# EAGLE design MGBC-PWR-01_1-3_2 (EAGLE 9.6.2)
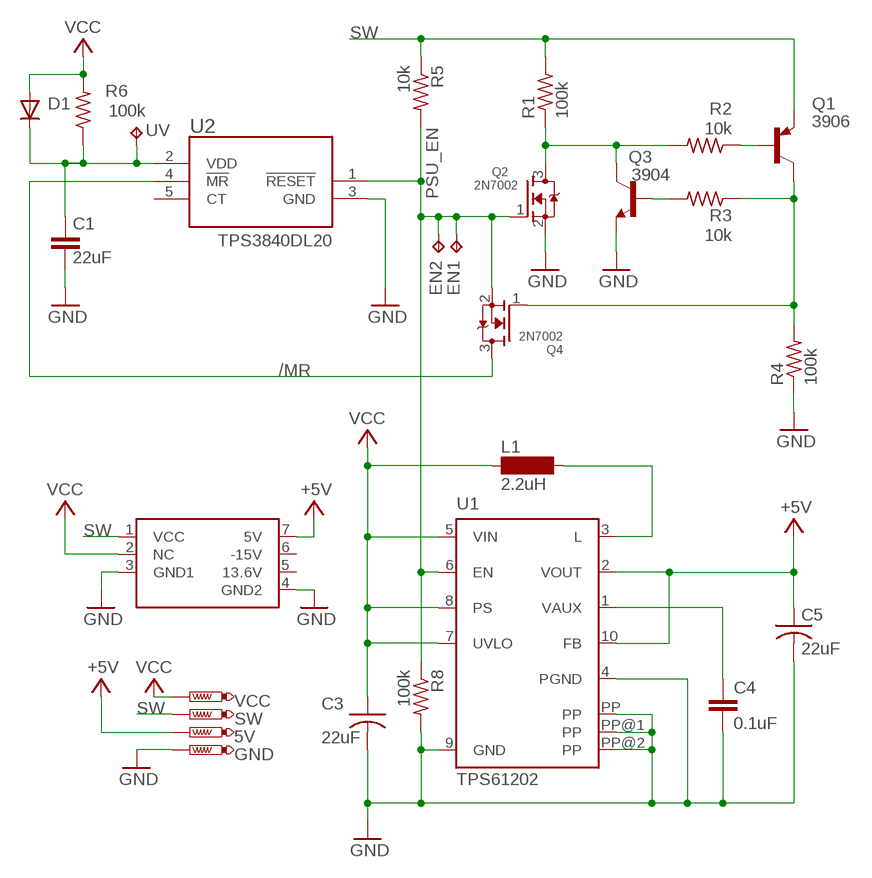
[diagram p0: schematic, sheet 1]

## Parts
5V  PTR1B1,27  [B1,27]
C1  22uF  C-EUC0805  [C0805]
C3  22uF  C-USC0805  [C0805]
C4  0.1uF  C-EUC0603  [C0603]
C5  22uF  C-USC0805  [C0805]
D1  DIODESOD-323F  [SOD-323F]
EN1  TPTP09R  [TP09R]
EN2  TPB1,27  [B1,27]
GND  PTR1B1,27  [B1,27]
L1  2.2uH  LQH3NPN2R2  [1212]
Q1  MMBT3906LT1SMD  [SOT23-BEC]
Q2  2N7002  MOSFET-NREFLOW  [SOT23]
Q3  3904  MMBT3904LT1-NPN-SOT23-BEC  [SOT23-BEC]
Q4  2N7002  MOSFET-NREFLOW  [SOT23]
R1  100k  R-US_R0603  [R0603]
R2  10k  R-US_R0603  [R0603]
R3  10k  R-US_R0603  [R0603]
R4  100k  R-US_R0603  [R0603]
R5  10k  R-US_R0603  [R0603]
R6  100k  R-US_R0603  [R0603]
R8  100k  R-US_R0603  [R0603]
SW  PTR1B1,27  [B1,27]
U1  TPS61202  [S-PDSO-N10]
U2  TPS3840  [SOT-23-5]
U$1  MGB-PWR_BD  [MGB-PWRBD]
UV  TPB1,27  [B1,27]
VCC  PTR1B1,27  [B1,27]

## Nets
+5V: 5V.TP C5.1 U1.2(VOUT) U1.10(FB) U$1.7(5V)
/MR: Q4.3(D) U2.4(!MR)
GND: C1.2 C3.2 C4.2 C5.2 GND.TP Q2.2(S) Q3.E R4.1 R8.2 U1.4(PGND) U1.9(GND) U1.PP U1.PP@1(PP) U1.PP@2(PP) U2.3(GND) U$1.3(GND1) U$1.4(GND2)
N$3: C1.1 D1.C R6.1 U2.2(VDD) UV.TP
N$10: Q1.B R2.1
N$12: Q1.C Q4.1(G) R3.1 R4.2
N$13: Q3.B R3.2
N$14: Q2.3(D) Q3.C R1.1 R2.2
N$26: L1.2 U1.3(L)
N$34: C4.1 U1.1(VAUX)
PSU_EN: EN1.TP EN2.TP Q2.1(G) Q4.2(S) R5.2 R8.1 U1.6(EN) U2.1(!RESET)
SW: Q1.E R1.2 R5.1 SW.TP U$1.1(VCC)
VCC: C3.1 D1.A L1.1 R6.2 U1.5(VIN) U1.7(UVLO) U1.8(PS) U$1.2(NC) VCC.TP
Unconnected: U2.5(CT)

## Notes on the sheet
- 3906
- TPS3840DL20

## Power pins joined to a net without a drawn wire
13.6V: U$1.5(13.6V)
-15V: U$1.6(-15V)

## Library data of the parts
5V GND SW VCC = testpad:PTR1: TEST PIN
C1 C4 = rcl:C-EU: CAPACITOR, European symbol; SPICEPREFIX: C
C3 C5 = rcl:C-US: CAPACITOR, American symbol; SPICEPREFIX: C
D1 = adafruit:DIODE: Diode SMADIODE - SMA Surface Mount Package 20V 1A Schottky Diode Digikey: 641-1014-6-ND DO-1N4148 - Through Hole Small Current Diode SOD-123 20V 1 A (.5mV Vf) Schottky Diode - Digikey: MBRX120TPMSCT-ND SOD-323 10V 570mA (.38mV Vf, 3ns) Schottky Diode - Digikey: ZLLS410CT-ND SOD-523 30V 30mA Schottky Diode (RB751S-40TE61) - Digikey: RB751S-40TE61CT-ND SOT23-R/W - SOT23 Package (R = Solder Paste/Reflow Ovens, W = Hand-Soldering) BAT54Film 40V 300mA - Digikey: 497-7162-1-ND
EN1 EN2 UV = testpad:TP: Test pad
L1 = gameboy:LQH3NPN2R2: INDUCTOR SMD power inductor; OC_FARNELL: unknown; OC_NEWARK: unknown
Q1 = transistor-pnp:MMBT3906*: PNP Transistror
Q2 Q4 = adafruit:MOSFET-N: N-Channel Mosfet 2N7002E - 60V 260mA SOT23 [Digikey: 2N7002ET1GOSTR-ND] - REEL BSH103 - 30V 850mA SOT23 [Digikey: 568-5013-1-ND]
Q3 = transistor-neu-to92:*-NPN-: NPN Transistror
R1-R6 R8 = rcl:R-US_: RESISTOR, American symbol; SPICEPREFIX: R
U1 = texas:TPS6120*: LOW INPUT VOLTAGE SYNCHRONOUS BOOST CONVERTER WITH 1.3-A SWITCHES Source: http://focus.ti.com/lit/ds/symlink/tps61200.pdf; MPN: TPS61202DRCR; OC_FARNELL: unknown; OC_NEWARK: 37M0069
U2 = SOT95P280X145-5N:TPS3840
U$1 = Game Boy:MGB-PWR_BD

## Board
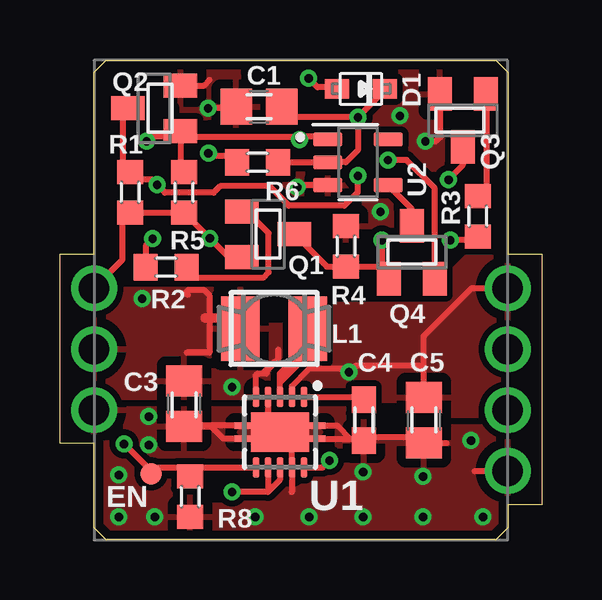
[diagram p1: board, top side]
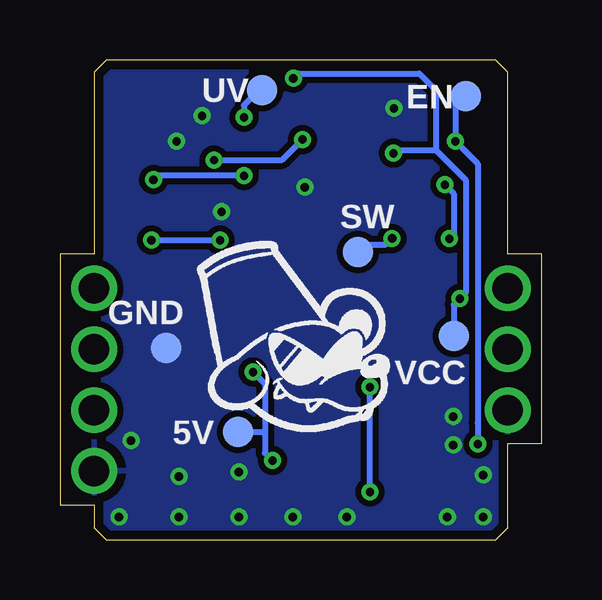
[diagram p2: board, bottom side, seen from below]

Size 20.1 x 20 mm. Coordinates in mm from the lower left corner, seen from the top.
Outline: 1.43,0.5 1.43,4.04 0,4.04 0,11.93 1.43,11.93 1.43,19.5 1.93,20 18.18,20 18.68,19.5 18.68,11.93 20.1,11.93 20.1,1.48 18.68,1.48 18.68,0.5 18.18,0 1.93,0 1.43,0.5
Copper layers (1*16): Top 0.0356mm / dielectric 1.5011mm / Bottom 0.0356mm
Design rules "jlcpcb *": minimum track width 7mil, minimum drill 13mil, track to track 7mil, track to pad 7mil, pad to pad 7mil, via to via 7mil, smd to smd 5mil, copper to edge 15mil, drill to drill 22mil, minimum pad ring 7mil, minimum via ring 7mil, stop-mask expansion 2.5mil, vias tented up to drill 14mil, thermal gap 15mil
tRestrict: area 16.3,17.1 to 16.7,19; area 10.7,12.8 to 11.2,13.5; area 4.2,17.3 to 4.6,18; area 6.2,16.3 to 6.6,17.1; area 3.7,18.8 to 4.1,19.5; area 8.2,9.4 to 9.2,10.5; area 6.2,1.9 to 7.2,3; area 2.7,10.9 to 6.2,12; area 0.1,5.8 to 1.1,9.8; area 11,10.3 to 16,12; area 19.3,2.8 to 20.6,10.3; area 7.9,18.8 to 8.4,19.5; 1 more areas
bRestrict: area 0.7,6 to 2.2,8; area 19.3,2.8 to 20.6,10.3

### Footprints (pad centres in the part's own frame; a part is rotated, then mirrored left to right if it is on the bottom)
B1,27 = smd 1.27 x 1.27: TP 0,0
C0805 = smd 1.3 x 1.5: 1 -0.95,0; 2 0.95,0
C0603 = smd 1.1 x 1: 1 -0.85,0; 2 0.85,0
SOD-323F = smd 1 x 0.8: A -1,0; C 1,0
TP09R = smd 0.9 x 0.9: TP 0,0
1212 = smd 1.6 x 2.7: 1 1.4,0; 2 -1.4,0
SOT23-BEC = smd 1 x 1.4: B -0.95,-1.1; C 0,1.1; E 0.95,-1.1
SOT23 = smd 1 x 1.4: 1 -0.95,-1.1; 2 0.95,-1.1; 3 0,1.1
R0603 = smd 1 x 1.1: 1 -0.85,0; 2 0.85,0
S-PDSO-N10 = smd 0.28 x 0.85: 1 -1,-1.475; 2 -0.5,-1.475; 3 0,-1.475; 4 0.5,-1.475; 5 1,-1.475; 6 1,1.475; 7 0.5,1.475; 8 0,1.475; 9 -0.5,1.475; 10 -1,1.475 | smd 2.4 x 1.65: PP 0,0 | smd 3.8 x 0.28: PP@1 0,0.275; PP@2 0,-0.275
SOT-23-5 = smd 1.21 x 0.59: 1 -1.255,0.95; 2 -1.255,0; 3 -1.255,-0.95; 4 1.255,-0.95; 5 1.255,0.95
MGB-PWRBD = drill 1.27: 1 -0.25,10.5; 2 -0.25,7.96; 3 -0.25,5.42; 4 17,2.88; 5 17,5.42; 6 17,7.96; 7 17,10.5

### Placement (x,y rotation side)
5V  12.68,4.5 0 bottom
C1  8.3,18.06 180 top
C3  5.17,5.69 270 top
C4  12.68,5 270 top
C5  15.18,5 270 top
D1  12.55,18.81 0 top
EN1  3.8,2.75 0 top
EN2  3.17,18.5 0 bottom
GND  15.68,8 0 bottom
L1  8.93,8.81 180 top
Q1  8.68,12.75 270 top
Q2  3.92,18 90 top
Q3  16.8,17.5 180 top
Q4  14.68,12 0 top
R1  2.92,14.5 270 top
R2  4.42,11.38 180 top
R3  17.43,13.5 90 top
R4  11.93,12.25 270 top
R5  5.17,14.5 90 top
R6  8.24,15.75 180 top
R8  5.42,1.81 270 top
SW  7.67,12 0 bottom
U1  9.18,4.5 180 top
U2  12.43,15.75 0 top
U$1  1.68,0 0 top
UV  11.68,18.75 0 bottom
VCC  3.67,8.5 0 bottom

### Tracks (layer width: path | path; a pad name or v marks a point on that pad's centre or on a via)
+5V  (via drill 0.35)
  Top 0.25: U1.2 9.67,6.42 10.37,7.12 11.93,7.12 v12.05,7 12.3,7.25 15.18,7.25 | C5.1 15.18,7.25 | U1.10 10.95,3.02 v11.24,3.31 | 15.18,7.25 15.18,8.5 17.18,10.5 U$1.7
  Bottom 0.25: v11.24,3.31 11.55,3.62 11.55,4.5 | 11.55,4.5 11.55,6.5 v12.05,7 | 5V.TP 11.55,4.5
  pour Top (isolate 0.25, rank 2): 9.18,5.19 9.18,10 15.18,10 17.18,12 20.05,12 20.05,5.19
  pour Top (no thermals): 14.93,8.81 15.86,9.75 16.93,9.75 17.3,9.38 17.3,7.25 14.93,7.25
/MR
  Top 0.25: U2.4 14.68,13.8 Q4.3
GND  (via drill 0.35)
  Top 0.25: U2.3 9.98,14.8 v9.89,14.71 | Q2.2 6,18.95 6.24,19.19 | 7.2,18.31 C1.2 7.29,18 v6.17,18 | Q3.E 15.85,16.8 15.68,16.62 v15.24,16.62 | U1.4 8.68,5 | 8.68,5 U1.PP | 8.68,5 8.47,4.8 5.24,4.8 5.3,4.74 6.3,4.74 6.81,4.22 U1.PP@1 12.11,4.22 | 12.11,4.22 12.6,4.22 C4.2 12.8,4.28 14.95,4.28 C5.2 16.12,4.05 | U1.PP@2 11.56,4.78 12.11,4.22 | 17.29,2.88 U$1.4 | 9.68,4.5 U1.9 9.68,2
  other vias: 13.36,13.69 3.7,5.15 3.7,3.96 8.14,0.96 10.39,0.96 12.64,0.96 17.64,0.96 15.14,0.96 12.64,2.84 15.14,2.65 17.14,4.15 2.45,2.71 2.45,0.96 3.95,0.96 14.18,17.69
  pour Top (isolate 0.25, rank 6): 1.43,20 18.68,20 18.68,0 1.43,0
  pour Bottom (isolate 0.25, rank 6): 1.43,20 18.68,20 18.68,0 1.43,0
  pour Top (no thermals): 12.68,0.75 12.68,2.75 15.18,2.75 15.18,0.75
  pour Bottom (no thermals): 17.18,7 17.18,9.5 16.93,9.75 14.93,9.75 14.43,9.25 14.43,6.75 16.43,6.75 16.93,6.75
N$3  (via drill 0.35)
  Top 0.25: R6.1 U2.2 11.93,15.75 12.43,16.25 v12.43,17.62 | v12.43,17.62 9.34,17.62 C1.1 | v12.43,17.62 13.53,18.73 D1.C
  Bottom 0.254: UV.TP 11.93,18.62 12.43,18.12 v12.43,17.62
N$10
  Top 0.25: R2.1 5.71,10.94 8.46,10.94 8.7,11.18 8.7,12.8 7.8,13.7 Q1.B
N$12  (via drill 0.35)
  Top 0.25: Q1.C 11.12,11.4 R4.2 13.6,11.4 13.73,11.28 | 13.85,11.4 13.73,11.28 | 13.73,11.28 Q4.1 13.73,11.01 13.43,11.31 v13.43,12.5 | R3.1 17.27,12.5 v16.28,12.5
  Bottom 0.25: v16.28,12.5 v13.43,12.5
N$13
  Top 0.25: R3.2 17.8,14.72 17.8,18.12 17.75,18.18 Q3.B
N$14  (via drill 0.35)
  Top 0.25: Q2.3 2.61,17.79 2.61,15.66 R1.1 3.24,15.04 3.83,15.04 v4.05,14.81 4.38,14.48 6.41,14.48 6.68,14.75 8.74,14.75 9.55,13.94 11.86,13.94 12.43,14.5 v12.43,15.19 | v3.86,12.56 3.58,12.28 R2.2 | 16.8,16.27 Q3.C 16.8,15.62 v16.2,15.03
  Bottom 0.25: v4.05,14.81 3.67,14.44 3.67,12.75 v3.86,12.56 | v12.43,15.19 16.04,15.19 v16.2,15.03
N$26
  Top 0.25: U1.3 9.18,6.56 | 9.18,6.56 9.43,6.81 | 9.61,7 9.43,6.81 | 9.61,7 9.86,7.25 | 9.86,7.25 10.18,7.56 | 9.18,6.94 9.57,7.33 | 9.49,7.25 10.09,7.85 | 9.18,6.56 9.18,6.94 | 9.18,6.94 9.3,6.94 | 9.46,7.22 9.24,7 9.3,6.94 | 9.49,7.25 9.46,7.22 | 9.49,7.25 9.64,7.25 | 9.8,7.25 9.86,7.25 | 9.46,7.22 9.61,7.06 | 9.61,7 9.61,7.06 | 9.43,6.81 9.33,6.91 | 9.33,6.91 9.3,6.94 | 9.83,7.5 9.78,7.55 | 9.57,7.33 9.64,7.25 | 9.64,7.25 9.8,7.25 | 9.8,7.25 10.33,7.78 L1.2 10.33,8.09 9.78,7.55 | 9.78,7.55 9.57,7.33 | 9.61,7.06 9.49,7.06 9.33,6.91
N$34
  Top 0.25: U1.1 12.55,5.97 C4.1
PSU_EN  (via drill 0.35)
  Top 0.25: Q2.1 5.03,15.5 R5.2 | Q2.1 5.25,16.82 9.99,16.82 | U2.1 11.17,16.76 11.11,16.82 9.99,16.82 | Q4.2 15.62,14.68 14.46,15.84 v13.68,15.84 | v9.99,16.7 9.99,16.82 | Q2.1 4.79,16.81 3.8,16.81 v3.61,16.62 | R8.1 5.79,3.02 | 5.79,3.02 U1.6 | v2.67,4 3.65,3.02 5.79,3.02
  Top 0.254: EN1.TP 3.65,2.9 3.65,3.02
  Bottom 0.25: v13.68,15.84 10.85,15.84 v9.99,16.7 | v3.61,16.62 2.68,15.69 2.68,4.9 2.67,4.89 v2.67,4
  Bottom 0.254: EN2.TP 3.24,18.5 3.61,18.12 v3.61,16.62
SW  (via drill 0.35)
  Top 0.25: U$1.1 1.43,10.51 2.61,11.7 2.61,13.33 R1.2 R5.1 v6.25,12.57 7.02,11.8 Q1.E
  Bottom 0.25: v6.25,12.57 6.5,12.32 7.49,12.32 SW.TP
VCC  (via drill 0.35)
  Top 0.25: R6.2 7.14,16 6.32,16 v6.19,16.12 | U1.7 8.68,2 | U1.8 9.18,2.5 8.68,2 | 8.68,2 v7.17,2 | 6.05,9.25 6.17,9.25 | 7.09,9.25 L1.1 | 5.33,10.22 5.24,10.31 5.36,10.44 5.99,10.44 6.24,10.19 6.24,9.25 6.24,7.81 5.3,7.81 | 9.11,7.94 9.11,7.54 8.62,7.05 8.62,6.95 8.61,6.94 8.24,6.94 8.18,6.88 U1.5 | 8.44,6.93 8.93,7.42 | D1.A 11.51,18.88 10.74,18.88 v10.37,19.25
  Top 0.4: 6.05,9.25 6.24,9.25 | 6.17,9.25 7.09,9.25
  Bottom 0.25: 4.42,16.25 3.17,15 3.17,10.31 v3.42,10.06 3.67,9.81 VCC.TP | v7.17,2 v7.17,6.38 | v10.37,19.25 v10.36,19.25 10.16,19.45 5.11,19.45 4.42,18.77 4.42,16.25 | v6.19,16.12 6.07,16.25 4.42,16.25
  pour Top (isolate 0.25): 0.18,10.44 9.18,10.44 9.18,5.94 0.18,5.94
  pour Top (no thermals): 4.17,9.62 4.17,7.94 6.17,7.94 6.17,10.06 4.17,10.06

### Text on the board
tNames: EN
bNames: EN | SW | GND | VCC | 5V
bStop: v1.3